# EAGLE design ESP_Ambient_sensors (EAGLE 9.1.1)
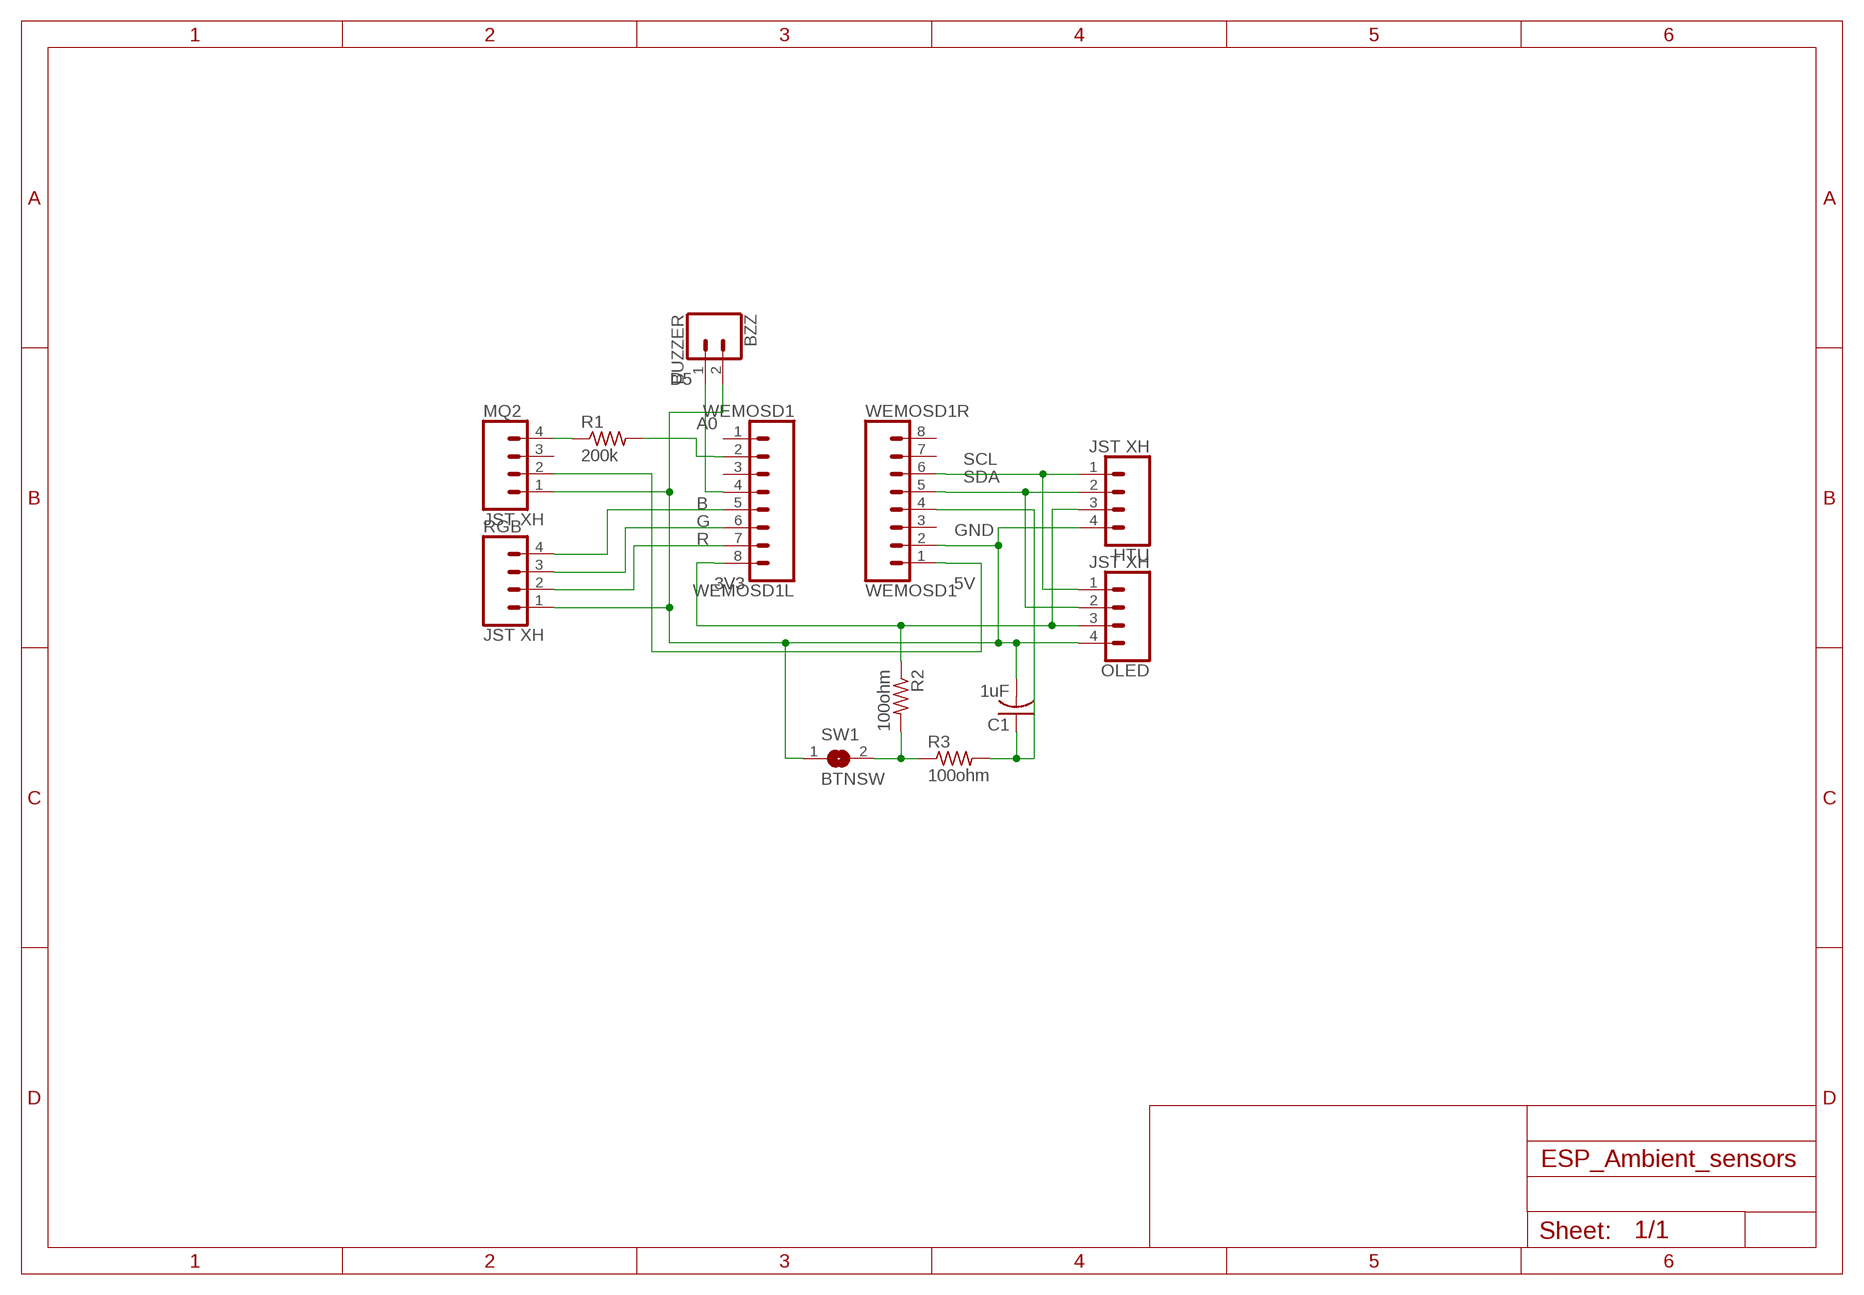
[diagram p0: schematic, sheet 1]

## Parts
BZZ  BUZZER  CONN_02  [1X02]
C1  1uF  C-USC0805  [C0805]
HTU  JST XH  CONN_04  [1X04]
MQ2  JST XH  CONN_04  [1X04]
OLED  JST XH  CONN_04  [1X04]
R1  200k  R-US_R0805  [R0805]
R2  100ohm  R-US_R0805  [R0805]
R3  100ohm  R-US_R0805  [R0805]
RGB  JST XH  CONN_04  [1X04]
SW1  BTNSW  SJW  [SJW]
WEMOSD1L  WEMOSD1  CONN_08"  [1X08]
WEMOSD1R  WEMOSD1  CONN_08"  [1X08]

## Nets
3V3: HTU.3 OLED.3 R2.1 WEMOSD1L.8
5V: MQ2.2 WEMOSD1R.1
A0: R1.2 WEMOSD1L.2
B: RGB.4 WEMOSD1L.5
D5: BZZ.1 WEMOSD1L.4
G: RGB.3 WEMOSD1L.6
GND: BZZ.2 C1.2 HTU.4 MQ2.1 OLED.4 RGB.1 SW1.1 WEMOSD1R.2
N$1: R2.2 R3.1 SW1.2
N$2: C1.1 R3.2 WEMOSD1R.4
N$9: MQ2.4 R1.1
R: RGB.2 WEMOSD1L.7
SCL: HTU.1 OLED.1 WEMOSD1R.6
SDA: HTU.2 OLED.2 WEMOSD1R.5
Unconnected: MQ2.3 WEMOSD1L.1 WEMOSD1L.3 WEMOSD1R.3 WEMOSD1R.7 WEMOSD1R.8

## Library data of the parts
BZZ = SparkFun-Connectors:CONN_02: Multi connection point. Often used as Generic Header-pin footprint for 0.1 inch spaced/style header connections On any of the 0.1 inch spaced packages, you can populate with these: Break Away Headers - Straight <https://www.sparkfun.com/products/116> (PRT-00116) Break Away Male Headers - Right Angle <https://www.sparkfun.com/products/553> (PRT-00553) Female Headers <https://www.sparkfun.com/products/115> (PRT-00115) Break Away Headers - Machine Pin <https://www.sparkfun.com/products/117> (PRT-00117) Break Away Female Headers - Swiss Machine Pin <https://www.sparkfun.com/products/743> (PRT-00743) For SCREWTERMINALS and SPRING TERMINALS visit here: Screw Terimnals on SparkFun.com <https://www.sparkfun.com/search/results?term=Screw+Terminals> (5mm/3.5mm/2.54mm spacing) This device is also useful as a general connection point to wire up your design to another part of your project. Our various solder wires solder well into these plated through hole pads. Hook-Up Wire - Assortment (Stranded, 22 AWG) <https://www.sparkfun.com/products/11375> (PRT-11375) Hook-Up Wire - Assortment (Solid Core, 22 AWG) <https://www.sparkfun.com/products/11367> (PRT-11367) View the entire wire category on our website here <https://www.sparkfun.com/categories/141> Special notes: Molex polarized connector foot print use with: PRT-08233 with associated crimp pins and housings. 2.54_SCREWTERM for use with PRT-10571. 3.5mm Screw Terminal footprints for PRT-08084 5mm Screw Terminal footprints for use with PRT-08432
C1 = rcl:C-US: CAPACITOR, American symbol; SPICEPREFIX: C
HTU MQ2 OLED RGB = SparkFun-Connectors:CONN_04: Multi connection point. Often used as Generic Header-pin footprint for 0.1 inch spaced/style header connections On any of the 0.1 inch spaced packages, you can populate with these: Break Away Headers - Straight <https://www.sparkfun.com/products/116> (PRT-00116) Break Away Male Headers - Right Angle <https://www.sparkfun.com/products/553> (PRT-00553) Female Headers <https://www.sparkfun.com/products/115> (PRT-00115) Break Away Headers - Machine Pin <https://www.sparkfun.com/products/117> (PRT-00117) Break Away Female Headers - Swiss Machine Pin <https://www.sparkfun.com/products/743> (PRT-00743) For SCREWTERMINALS and SPRING TERMINALS visit here: Screw Terimnals on SparkFun.com <https://www.sparkfun.com/search/results?term=Screw+Terminals> (5mm/3.5mm/2.54mm spacing) This device is also useful as a general connection point to wire up your design to another part of your project. Our various solder wires solder well into these plated through hole pads. Hook-Up Wire - Assortment (Stranded, 22 AWG) <https://www.sparkfun.com/products/11375> (PRT-11375) Hook-Up Wire - Assortment (Solid Core, 22 AWG) <https://www.sparkfun.com/products/11367> (PRT-11367) View the entire wire category on our website here <https://www.sparkfun.com/categories/141> Special notes: Molex polarized connector foot print use with SKU : PRT-08231 with associated crimp pins and housings. 1MM SMD Version SKU: PRT-10208; PROD_ID: CONN-09696
R1-R3 = rcl:R-US_: RESISTOR, American symbol; SPICEPREFIX: R
SW1 = jumper:SJ: SMD solder JUMPER
WEMOSD1L WEMOSD1R = SparkFun-Connectors:CONN_08: Multi connection point. Often used as Generic Header-pin footprint for 0.1 inch spaced/style header connections On any of the 0.1 inch spaced packages, you can populate with these: Break Away Headers - Straight <https://www.sparkfun.com/products/116> (PRT-00116) Break Away Male Headers - Right Angle <https://www.sparkfun.com/products/553> (PRT-00553) Female Headers <https://www.sparkfun.com/products/115> (PRT-00115) Break Away Headers - Machine Pin <https://www.sparkfun.com/products/117> (PRT-00117) Break Away Female Headers - Swiss Machine Pin <https://www.sparkfun.com/products/743> (PRT-00743) Arduino Stackable Header - 8 Pin <https://www.sparkfun.com/products/9279> (PRT-09279) For SCREWTERMINALS and SPRING TERMINALS visit here: Screw Terimnals on SparkFun.com <https://www.sparkfun.com/search/results?term=Screw+Terminals> (5mm/3.5mm/2.54mm spacing) This device is also useful as a general connection point to wire up your design to another part of your project. Our various solder wires solder well into these plated through hole pads. Hook-Up Wire - Assortment (Stranded, 22 AWG) <https://www.sparkfun.com/products/11375> (PRT-11375) Hook-Up Wire - Assortment (Solid Core, 22 AWG) <https://www.sparkfun.com/products/11367> (PRT-11367) View the entire wire category on our website here <https://www.sparkfun.com/categories/141> Special notes: Molex polarized connector foot print use with SKU : PRT-08231 with associated crimp pins and housings. 1MM SMD Version SKU: PRT-10208 NOTES ON THE VARIANTS LOCK and LOCK_LONGPADS... This footprint was designed to help hold the alignment of a through-hole component (i.e. 6-pin header) while soldering it into place. You may notice that each hole has been shifted either up or down by 0.005 of an inch from it's more standard position (which is a perfectly straight line). This slight alteration caused the pins (the squares in the middle) to touch the edges of the holes. Because they are alternating, it causes a "brace" to hold the component in place. 0.005 has proven to be the perfect amount of "off-center" position when using our standard breakaway headers. Although looks a little odd when you look at the bare footprint, once you have a header in there, the alteration is very hard to notice. Also,if you push a header all the way into place, it is covered up entirely on the bottom side.; PROD_ID: CONN-08438

## Board
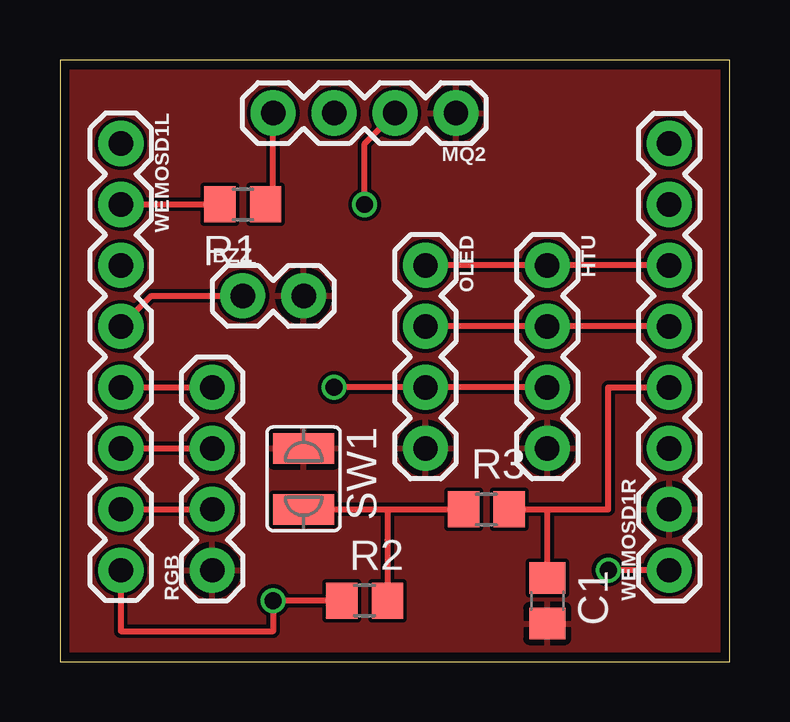
[diagram p1: board, top side]
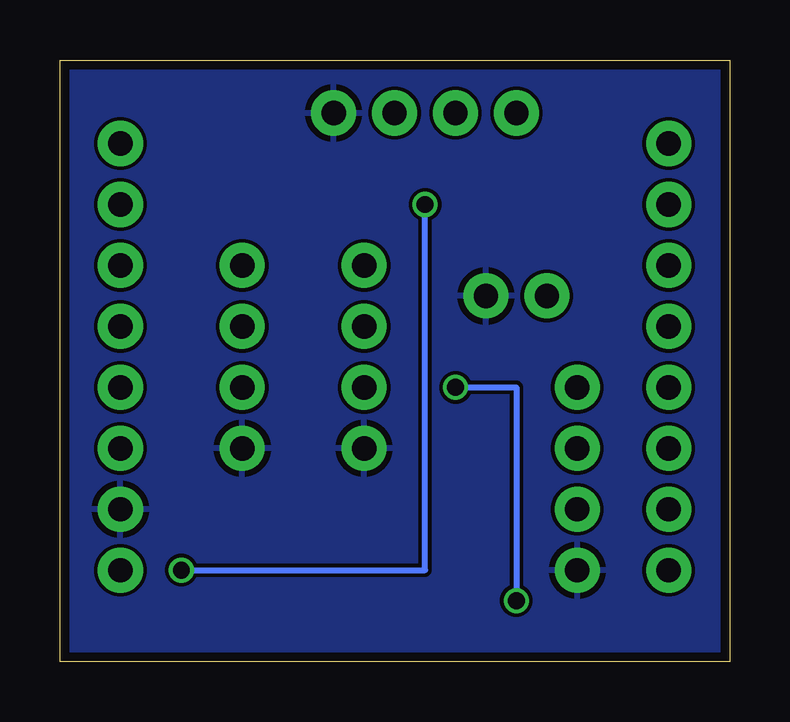
[diagram p2: board, bottom side, seen from below]

Size 27.92 x 25.07 mm. Coordinates in mm from the lower left corner, seen from the top.
Outline: 0,0 27.92,0 27.92,25.07 0,25.07 0,0
Copper layers (1*16): Top 0.035559375mm / dielectric 1.6mm / Bottom 0.035559375mm
Design rules "oshpark-2layer": minimum track width 6mil, minimum drill 10mil, track to track 6mil, track to pad 6mil, pad to pad 6mil, via to via 6mil, smd to smd 6mil, copper to edge 15mil, drill to drill 6mil, minimum pad ring 5mil, minimum via ring 5mil, stop-mask expansion 2.5mil, vias tented up to drill 0mil, thermal gap 10mil

### Footprints (pad centres in the part's own frame; a part is rotated, then mirrored left to right if it is on the bottom)
1X02 = drill 1.016 pad 1.88: 1 0,0; 2 2.54,0
C0805 = smd 1.3 x 1.5: 1 -0.95,0; 2 0.95,0
1X04 = drill 1.016 pad 1.88: 1 0,0; 2 2.54,0; 3 5.08,0; 4 7.62,0
R0805 = smd 1.3 x 1.5: 1 -0.95,0; 2 0.95,0
SJW = smd 1.27 x 2.54: 1 -1.27,0; 2 1.27,0
1X08 = drill 1.016 pad 1.88: 1 0,0; 2 2.54,0; 3 5.08,0; 4 7.62,0; 5 10.16,0; 6 12.7,0; 7 15.24,0; 8 17.78,0

### Placement (x,y rotation side)
BZZ  7.62,15.24 0 top
C1  20.32,2.54 270 top
HTU  20.32,16.51 270 top
MQ2  16.51,22.86 180 top
OLED  15.24,16.51 270 top
R1  7.62,19.05 180 top
R2  12.7,2.54 0 top
R3  17.78,6.35 0 top
RGB  6.35,3.81 90 top
SW1  10.16,7.62 270 top
WEMOSD1L  2.54,21.59 270 top
WEMOSD1R  25.4,3.81 90 top

### Tracks (layer width: path | path; a pad name or v marks a point on that pad's centre or on a via)
3V3  (via drill 0.7)
  Top 0.254: HTU.3 OLED.3 v11.43,11.43 | WEMOSD1L.8 2.54,1.27 8.89,1.27 | R2.1 v8.89,2.54 8.89,1.27 | 8.89,1.27
  Bottom 0.254: v11.43,11.43 8.89,11.43 v8.89,2.54
5V  (via drill 0.7)
  Top 0.254: WEMOSD1R.1 v22.86,3.81 | v12.7,19.05 12.7,21.59 MQ2.2
  Bottom 0.254: v22.86,3.81 12.7,3.81 v12.7,19.05
A0
  Top 0.254: WEMOSD1L.2 R1.2
B
  Top 0.254: WEMOSD1L.5 RGB.4
D5
  Top 0.254: WEMOSD1L.4 3.81,15.24 BZZ.1
G
  Top 0.254: WEMOSD1L.6 RGB.3
GND
  pour Top: 0,25.4 27.94,25.4 27.94,0 0,0
  pour Bottom: 0,25.4 27.94,25.4 27.94,0 0,0
N$1
  Top 0.254: SW1.2 13.65,6.35 | 13.65,6.35 13.65,5.08 R2.2 | 13.65,6.35 15.24,6.35 R3.1
N$2
  Top 0.254: R3.2 20.32,6.35 | 20.32,6.35 22.86,6.35 22.86,11.43 WEMOSD1R.4 | C1.1 20.32,6.35
N$9
  Top 0.254: R1.1 arc90 8.89,19.37 MQ2.4
R
  Top 0.254: WEMOSD1L.7 RGB.2
SCL
  Top 0.254: WEMOSD1R.6 HTU.1 OLED.1
SDA
  Top 0.254: WEMOSD1R.5 HTU.2 OLED.2

### Text on the board
_bsilk: RST | A0 | NC | 5V | GND | TX | A0 | DX | D0 | SCL | SCL | D5 | SDA | SDA | B | B | 3V3 | D3 | G | G | GND | D4 | R | R | GND | 3v3 | GND | flatbox, S.A | 5V | Guatemala | OpenSource